# EAGLE schematic M246A (EAGLE 6.6.0)
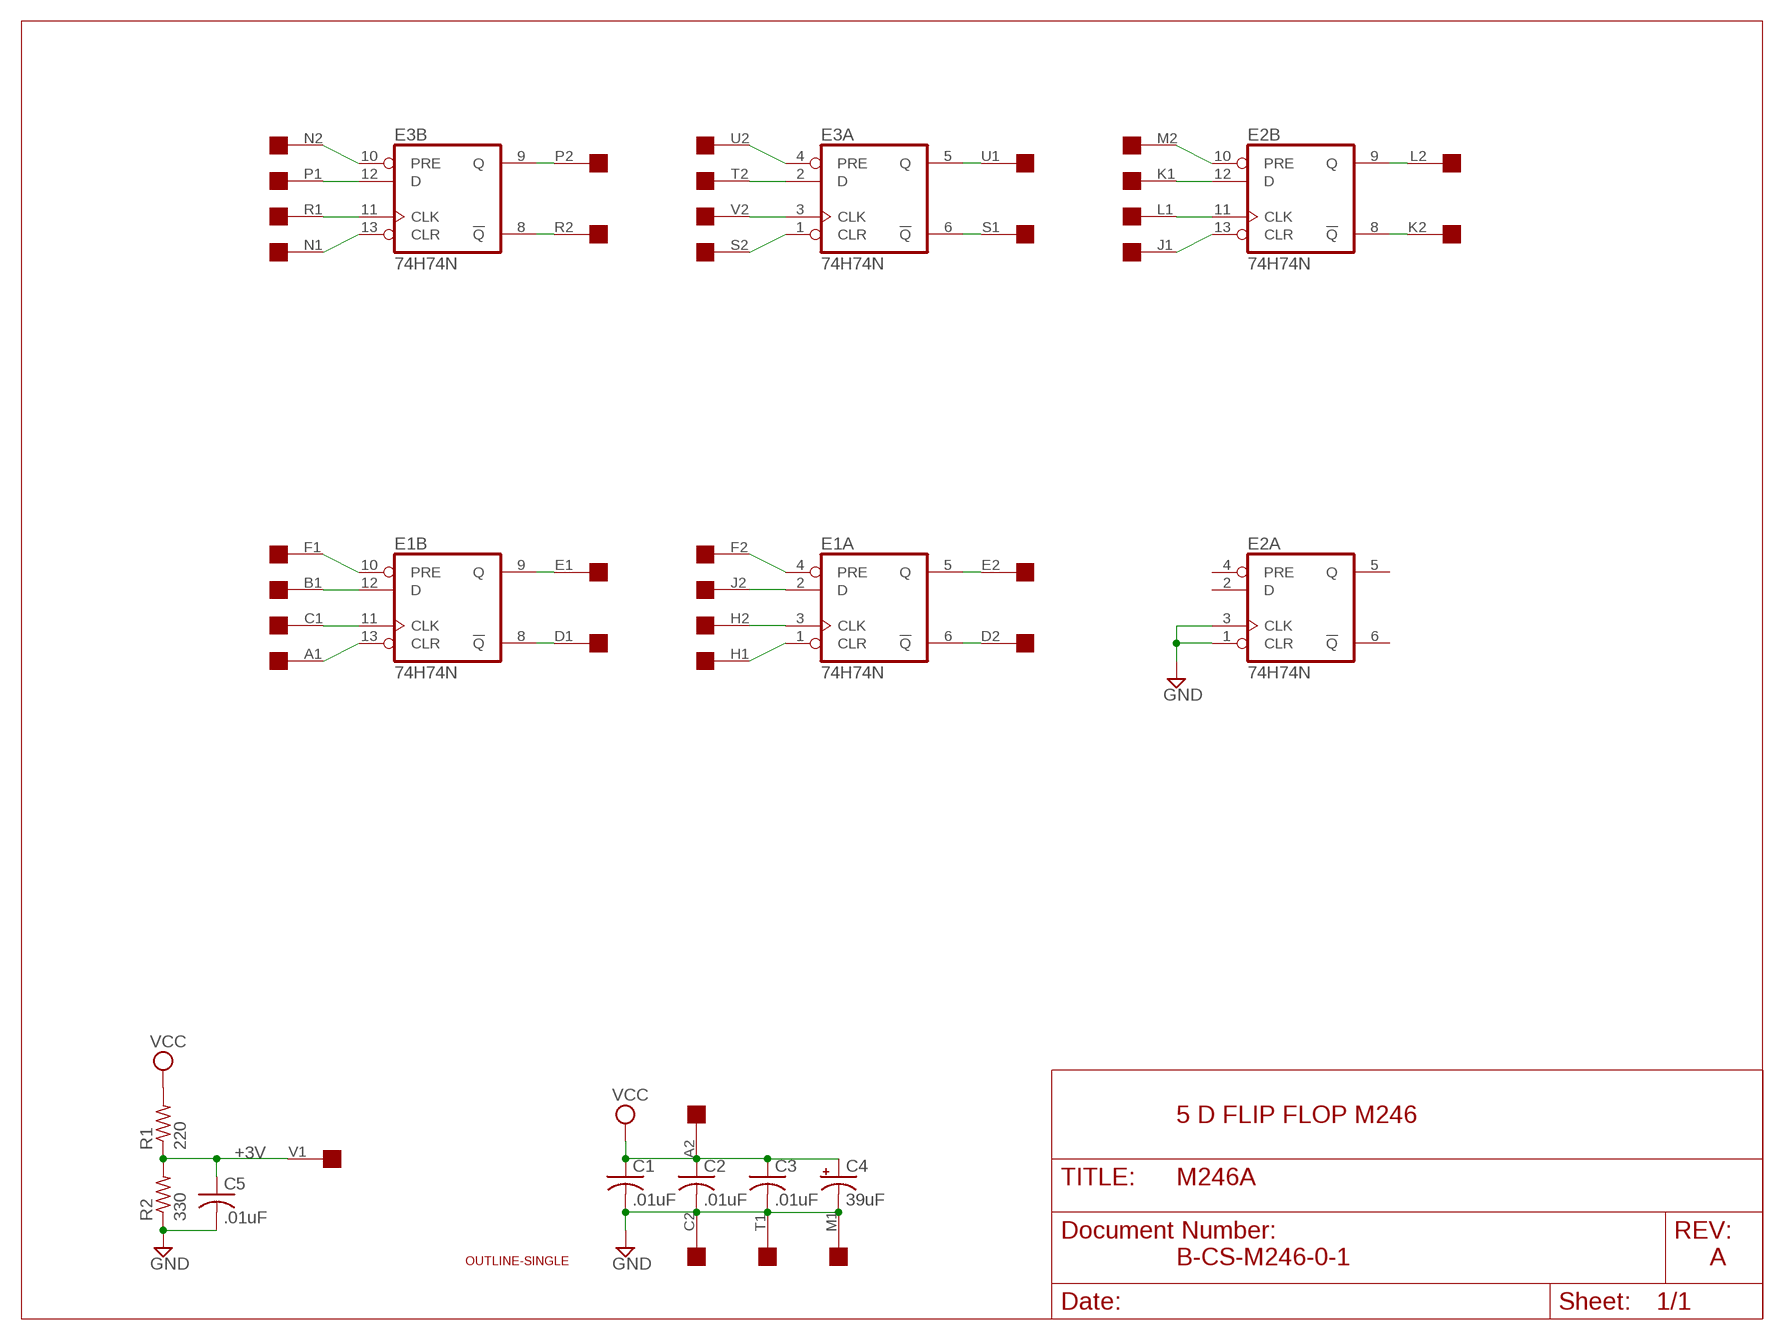
[diagram p0: schematic, sheet 1]

## Parts
C1  .01uF  C-US050-025X075  [C050-025X075]
C2  .01uF  C-US050-025X075  [C050-025X075]
C3  .01uF  C-US050-025X075  [C050-025X075]
C4  39uF  CPOL-USE20-8AXIAL  [E12-8]
C5  .01uF  C-US050-025X075  [C050-025X075]
E1  74H74N  74S74N  [DIL14]
E2  74H74N  74S74N  [DIL14]
E3  74H74N  74S74N  [DIL14]
R1  220  R-US_0207/10  [0207/10]
R2  330  R-US_0207/10  [0207/10]
U$1  OUTLINE-SINGLE  [SINGLE]
U$2  EDGE-2CONNECTOR  [EDGE-CON2]

## Nets
+3V: C5.1 R1.1 R2.2 U$2.V1
GND [Supply]: C1.2 C2.2 C3.2 C4.- C5.2 E2.1(A:CLR) E2.3(A:CLK) R2.1 U$2.C2 U$2.M1 U$2.T1
N$2: E3.5(A:Q) U$2.U1
N$3: E1.6(A:!Q) U$2.D2
N$4: E1.5(A:Q) U$2.E2
N$5: E1.2(A:D) U$2.J2
N$6: E1.4(A:PRE) U$2.F2
N$7: E1.3(A:CLK) U$2.H2
N$8: E1.1(A:CLR) U$2.H1
N$9: E3.1(A:CLR) U$2.S2
N$10: E3.3(A:CLK) U$2.V2
N$11: E3.8(B:!Q) U$2.R2
N$12: E3.9(B:Q) U$2.P2
N$13: E3.4(A:PRE) U$2.U2
N$14: E3.2(A:D) U$2.T2
N$15: E2.13(B:CLR) U$2.J1
N$16: E2.11(B:CLK) U$2.L1
N$17: E2.12(B:D) U$2.K1
N$18: E2.8(B:!Q) U$2.K2
N$19: E2.9(B:Q) U$2.L2
N$20: E2.10(B:PRE) U$2.M2
N$21: E1.13(B:CLR) U$2.A1
N$22: E1.11(B:CLK) U$2.C1
N$23: E1.10(B:PRE) U$2.F1
N$24: E1.8(B:!Q) U$2.D1
N$25: E1.9(B:Q) U$2.E1
N$26: E1.12(B:D) U$2.B1
N$27: E3.13(B:CLR) U$2.N1
N$28: E3.11(B:CLK) U$2.R1
N$29: E3.12(B:D) U$2.P1
N$30: E3.10(B:PRE) U$2.N2
N$31: E3.6(A:!Q) U$2.S1
VCC [Supply]: C1.1 C2.1 C3.1 C4.+ R1.2 U$2.A2
Unconnected: E2.2(A:D) E2.4(A:PRE) E2.5(A:Q) E2.6(A:!Q) U$2.B2

## Notes on the sheet
- 5 D FLIP FLOP M246
- B-CS-M246-0-1 | A

## Power pins joined to a net without a drawn wire
GND: E1.7(P:GND) E2.7(P:GND) E3.7(P:GND)
VCC: E1.14(P:VCC) E2.14(P:VCC) E3.14(P:VCC)

## Library data of the parts
C1-C3 C5 = rcl:C-US: CAPACITOR, American symbol
C4 = dec-con:CPOL-USE20-8AXIAL: A 0.8 inch electrolytic.
E1-E3 = 74xx-us:74*74: Dual D type positive edge triggered FLIP FLOP, preset and clear
R1 R2 = rcl:R-US_: RESISTOR, American symbol
U$1 = dec-con:OUTLINE-*: Board outlines for DEC boards.
U$2 = dec-con:EDGE-2: Double-Sided DEC edge connector.

## Net classes
0 default: width 0.813 mm
1 Supply: width 0.813 mm